# EAGLE design IPSv3.1 (EAGLE 9.6.1)

## Sheet 1 of 3: Circuit principal
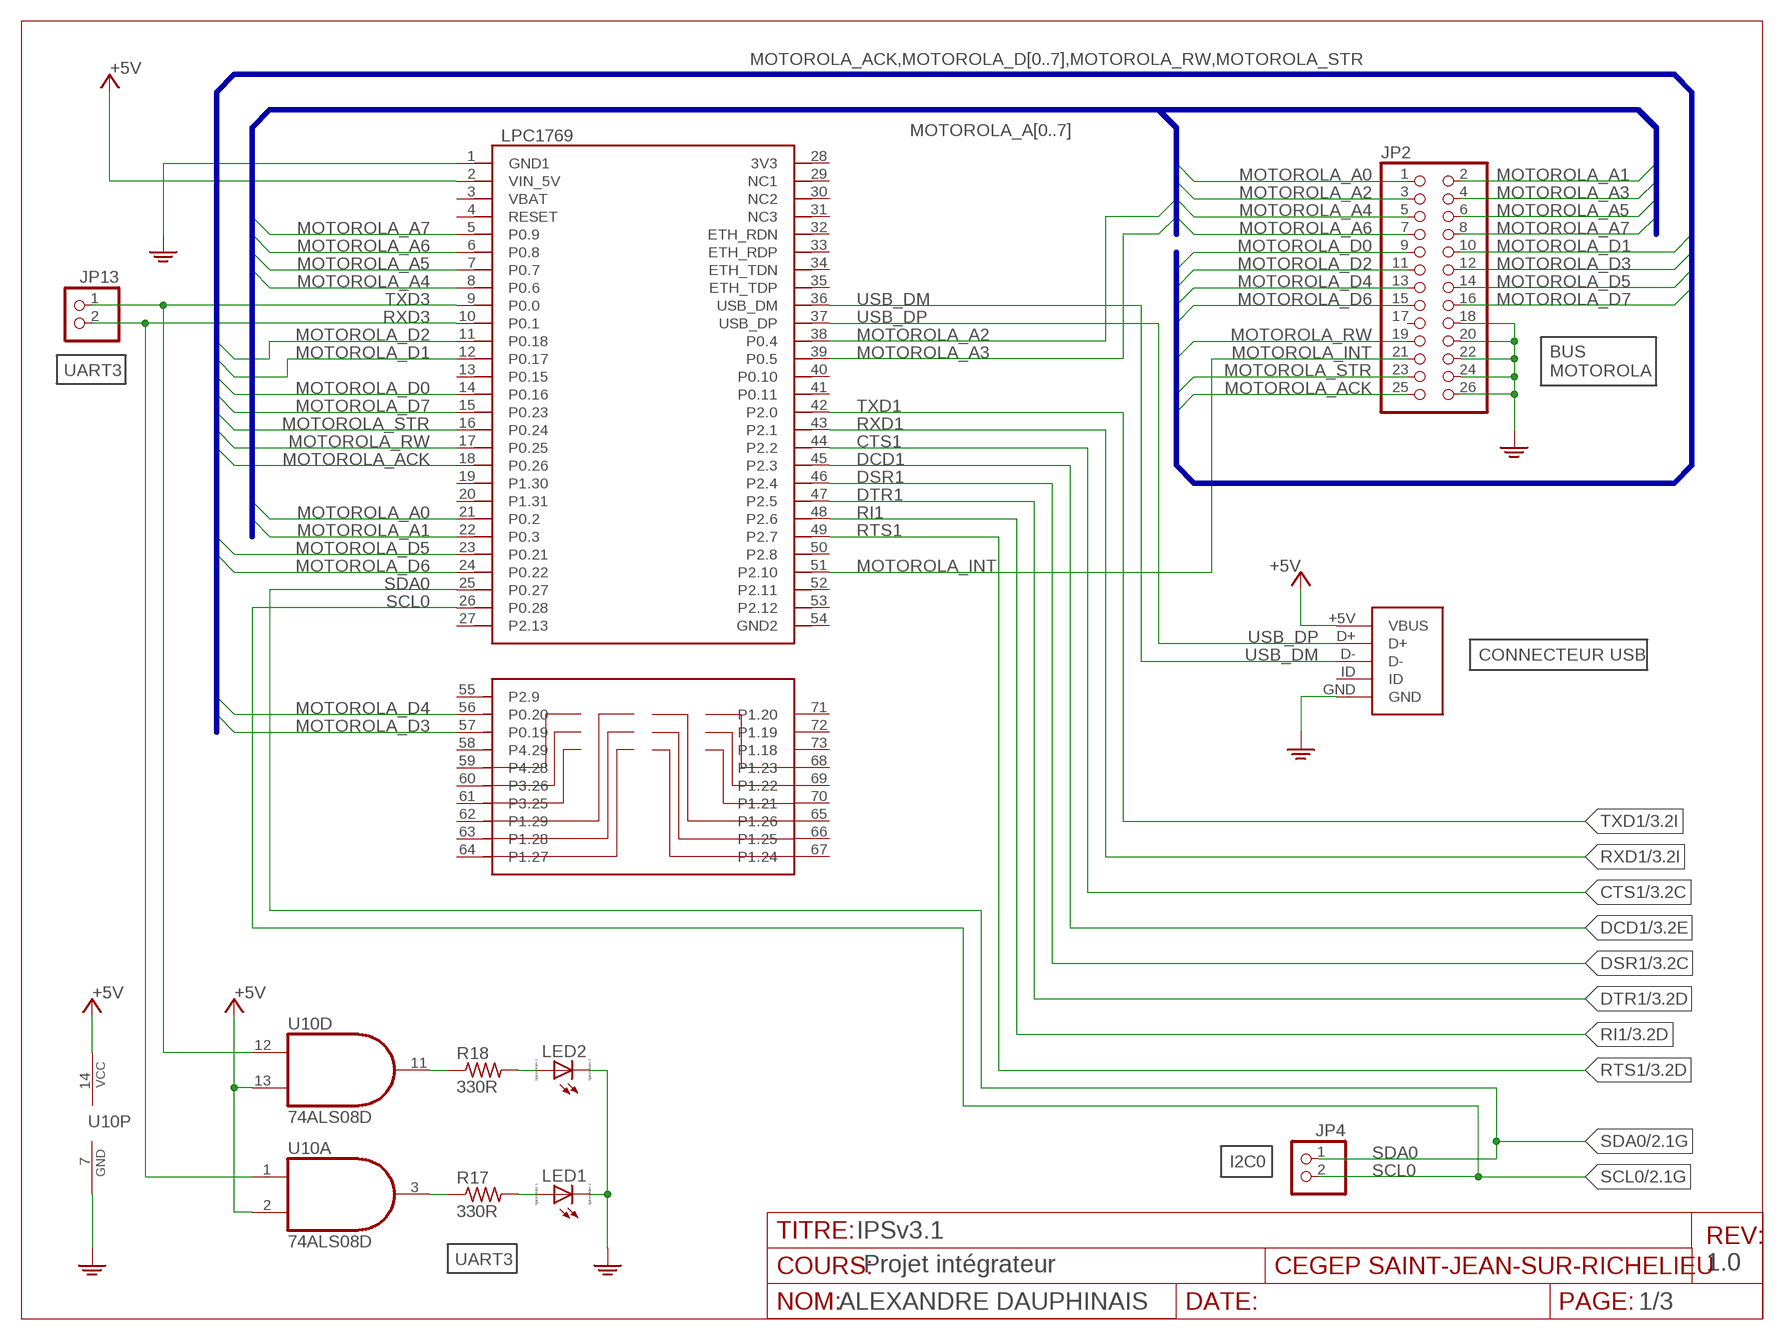
[diagram p0: schematic, sheet 1]

### Parts
JP2  PINHD-02X13M  [02X13M]
JP4  PINHD-01X02M  [01X02M]
JP13  PINHD-01X02M  [01X02M]
LED1  LED_BLEU  LED_E  [LED_1206]
LED2  LED_JAUNE  LED_E  [LED_1206]
M1  LPC_LPC1769  [LPC_LPC1769]
M2  USB-MICRO-BREAKOUT  [USB-MICRO-BREAKOUT]
R17  330R  R-US_R1206  [R1206]
R18  330R  R-US_R1206  [R1206]
U10  74ALS08D  [SO14]

### Nets
+5V: M1.2(VIN_5V) M2.+5V(VBUS) U10.2(A:I1) U10.13(D:I1) U10.14(P:VCC) ; also sheet 2,3
CTS1: M1.44(P2.2) ; also sheet 3
DCD1: M1.45(P2.3) ; also sheet 3
DSR1: M1.46(P2.4) ; also sheet 3
DTR1: M1.47(P2.5) ; also sheet 3
GND: JP2.18 JP2.20 JP2.22 JP2.24 JP2.26 LED1.C LED2.C M1.1(GND1) M2.GND U10.7(P:GND) ; also sheet 2,3
MOTOROLA_A0: JP2.1 M1.21(P0.2)
MOTOROLA_A1: JP2.2 M1.22(P0.3)
MOTOROLA_A2: JP2.3 M1.38(P0.4)
MOTOROLA_A3: JP2.4 M1.39(P0.5)
MOTOROLA_A4: JP2.5 M1.8(P0.6)
MOTOROLA_A5: JP2.6 M1.7(P0.7)
MOTOROLA_A6: JP2.7 M1.6(P0.8)
MOTOROLA_A7: JP2.8 M1.5(P0.9)
MOTOROLA_ACK: JP2.25 M1.18(P0.26)
MOTOROLA_D0: JP2.9 M1.14(P0.16)
MOTOROLA_D1: JP2.10 M1.12(P0.17)
MOTOROLA_D2: JP2.11 M1.11(P0.18)
MOTOROLA_D3: JP2.12 M1.57(P0.19)
MOTOROLA_D4: JP2.13 M1.56(P0.20)
MOTOROLA_D5: JP2.14 M1.23(P0.21)
MOTOROLA_D6: JP2.15 M1.24(P0.22)
MOTOROLA_D7: JP2.16 M1.15(P0.23)
MOTOROLA_INT: JP2.21 M1.51(P2.10)
MOTOROLA_RW: JP2.19 M1.17(P0.25)
MOTOROLA_STR: JP2.23 M1.16(P0.24)
N$2: R17.1 U10.3(A:O)
N$6: R18.1 U10.11(D:O)
N$23: LED2.A R18.2
N$24: LED1.A R17.2
RI1: M1.48(P2.6) ; also sheet 3
RTS1: M1.49(P2.7) ; also sheet 3
RXD1: M1.43(P2.1) ; also sheet 3
RXD3: JP13.2 M1.10(P0.1) U10.1(A:I0)
SCL0: JP4.2 M1.26(P0.28) ; also sheet 2
SDA0: JP4.1 M1.25(P0.27) ; also sheet 2
TXD1: M1.42(P2.0) ; also sheet 3
TXD3: JP13.1 M1.9(P0.0) U10.12(D:I0)
USB_DM: M1.36(USB_DM) M2.D-
USB_DP: M1.37(USB_DP) M2.D+
Unconnected: JP2.17 M1.3(VBAT) M1.4(RESET) M1.13(P0.15) M1.19(P1.30) M1.20(P1.31) M1.27(P2.13) M1.28(3V3) M1.29(NC1) M1.30(NC2) M1.31(NC3) M1.32(ETH_RDN) M1.33(ETH_RDP) M1.34(ETH_TDN) M1.35(ETH_TDP) M1.40(P0.10) M1.41(P0.11) M1.50(P2.8) M1.52(P2.11) M1.53(P2.12) M1.54(GND2) M1.55(P2.9) M1.58(P4.29) M1.59(P4.28) M1.60(P3.26) M1.61(P3.25) M1.62(P1.29) M1.63(P1.28) M1.64(P1.27) M1.65(P1.26) M1.66(P1.25) M1.67(P1.24) M1.68(P1.23) M1.69(P1.22) M1.70(P1.21) M1.71(P1.20) M1.72(P1.19) M1.73(P1.18) M2.ID

### Buses
MOTOROLA_ACK,MOTOROLA_D[0..7],MOTOROLA_RW,MOTOROLA_STR
MOTOROLA_A[0..7]

### Notes on the sheet
- LPC1769
- UART3
- BUS
  MOTOROLA
- CONNECTEUR USB
- I2C0
- UART3
- Projet intégrateur

## Sheet 2 of 3: I2C0
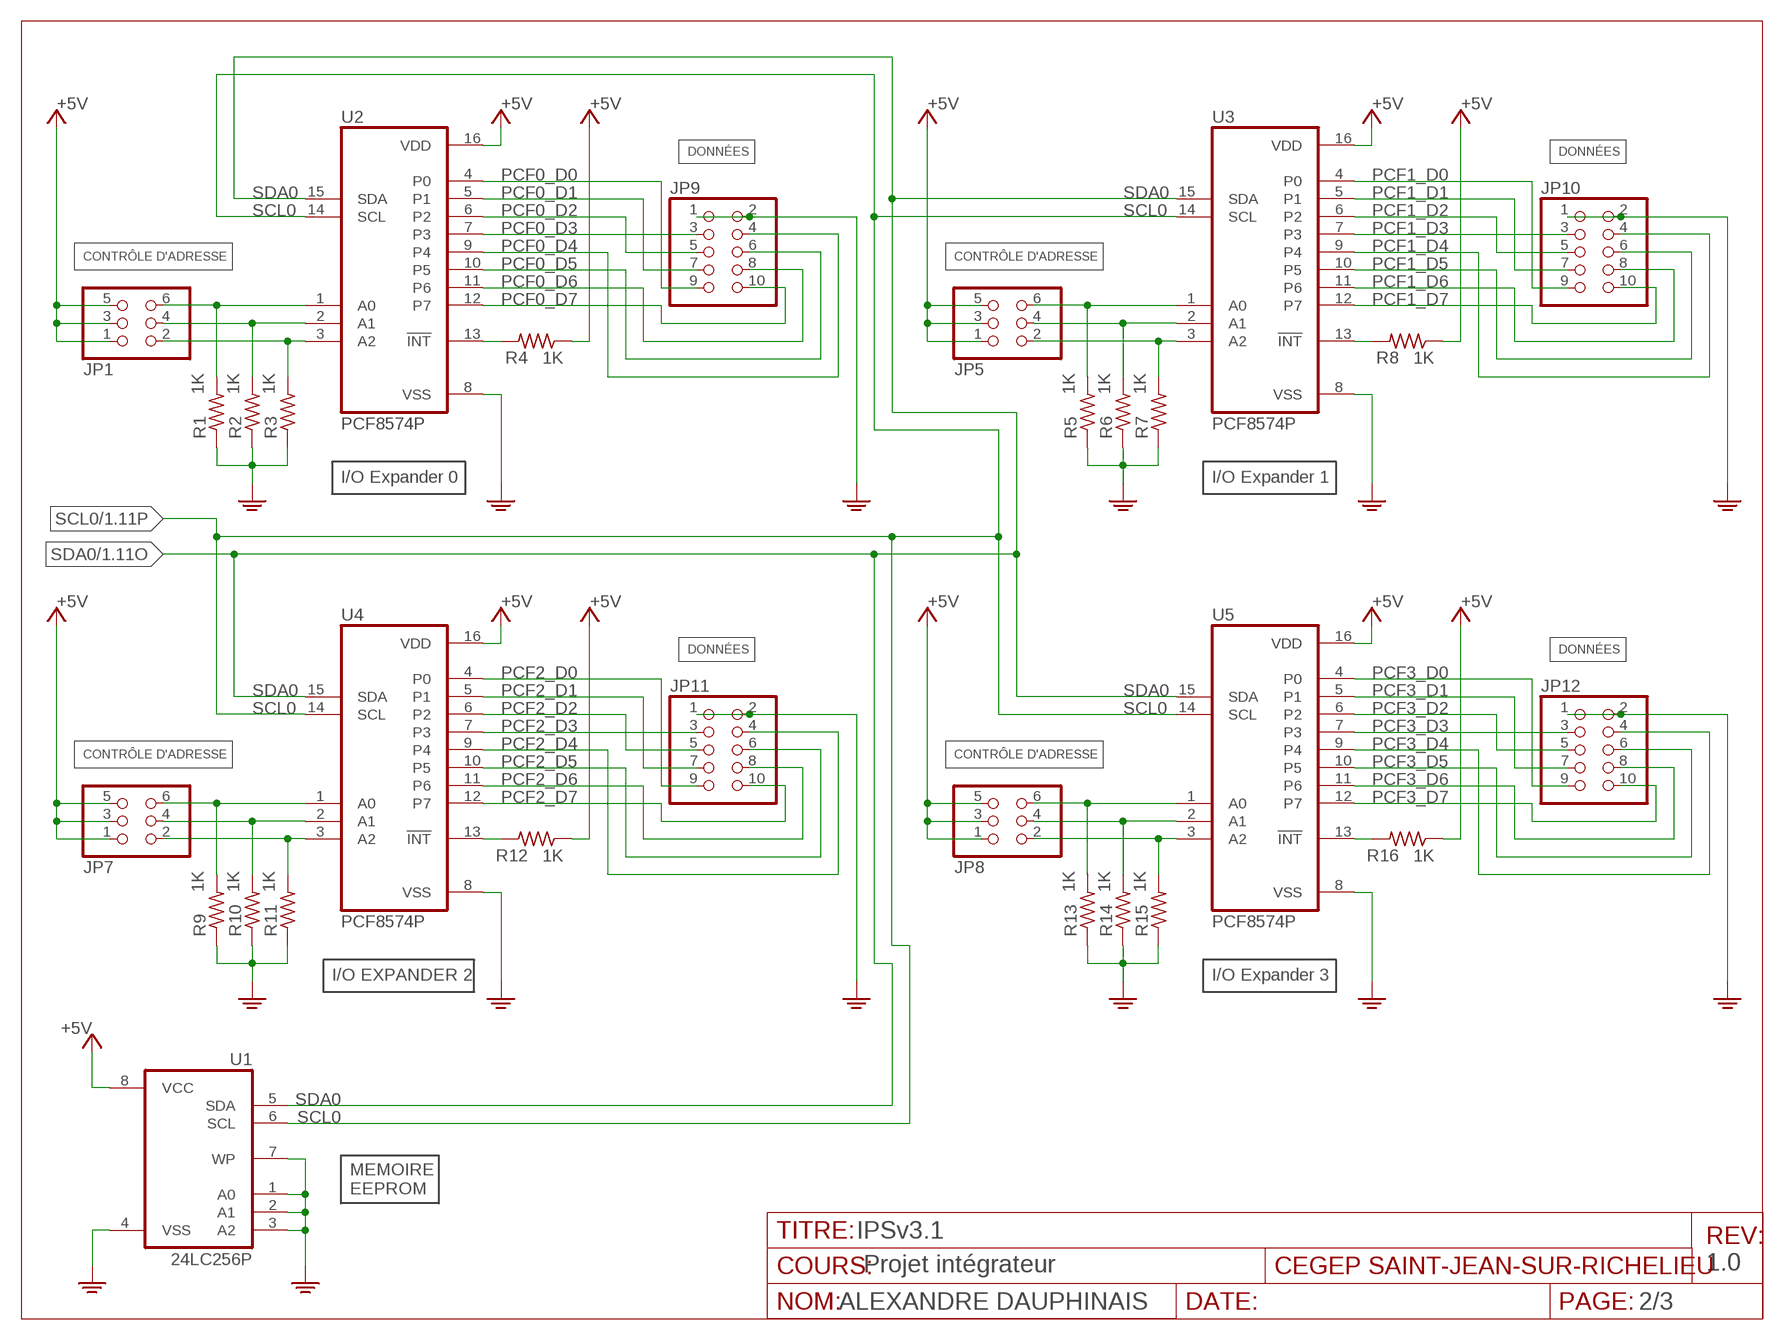
[diagram p1: schematic, sheet 2]

### Parts
JP1  PINHD-02X03M  [02X03M]
JP5  PINHD-02X03M  [02X03M]
JP7  PINHD-02X03M  [02X03M]
JP8  PINHD-02X03M  [02X03M]
JP9  PINHD-02X05M  [02X05M]
JP10  PINHD-02X05M  [02X05M]
JP11  PINHD-02X05M  [02X05M]
JP12  PINHD-02X05M  [02X05M]
R1  1K  R-US_R1206  [R1206]
R2  1K  R-US_R1206  [R1206]
R3  1K  R-US_R1206  [R1206]
R4  1K  R-US_R1206  [R1206]
R5  1K  R-US_R1206  [R1206]
R6  1K  R-US_R1206  [R1206]
R7  1K  R-US_R1206  [R1206]
R8  1K  R-US_R1206  [R1206]
R9  1K  R-US_R1206  [R1206]
R10  1K  R-US_R1206  [R1206]
R11  1K  R-US_R1206  [R1206]
R12  1K  R-US_R1206  [R1206]
R13  1K  R-US_R1206  [R1206]
R14  1K  R-US_R1206  [R1206]
R15  1K  R-US_R1206  [R1206]
R16  1K  R-US_R1206  [R1206]
U1  24LC256P  [DIL08]
U2  PCF8574P  [DIL16]
U3  PCF8574P  [DIL16]
U4  PCF8574P  [DIL16]
U5  PCF8574P  [DIL16]

### Nets
+5V: JP1.1 JP1.3 JP1.5 JP5.1 JP5.3 JP5.5 JP7.1 JP7.3 JP7.5 JP8.1 JP8.3 JP8.5 R4.1 R8.1 R12.1 R16.1 U1.8(VCC) U2.16(VDD) U3.16(VDD) U4.16(VDD) U5.16(VDD) ; also sheet 1,3
GND: JP9.1 JP9.2 JP10.1 JP10.2 JP11.1 JP11.2 JP12.1 JP12.2 R1.1 R2.1 R3.1 R5.1 R6.1 R7.1 R9.1 R10.1 R11.1 R13.1 R14.1 R15.1 U1.1(A0) U1.2(A1) U1.3(A2) U1.4(VSS) U1.7(WP) U2.8(VSS) U3.8(VSS) U4.8(VSS) U5.8(VSS) ; also sheet 1,3
N$1: R8.2 U3.13(!INT)
N$3: R12.2 U4.13(!INT)
N$4: R4.2 U2.13(!INT)
N$8: R16.2 U5.13(!INT)
PCF0_A0: JP1.6 R1.2 U2.1(A0)
PCF0_A1: JP1.4 R2.2 U2.2(A1)
PCF0_A2: JP1.2 R3.2 U2.3(A2)
PCF0_D0: JP9.9 U2.4(P0)
PCF0_D1: JP9.7 U2.5(P1)
PCF0_D2: JP9.5 U2.6(P2)
PCF0_D3: JP9.3 U2.7(P3)
PCF0_D4: JP9.4 U2.9(P4)
PCF0_D5: JP9.6 U2.10(P5)
PCF0_D6: JP9.8 U2.11(P6)
PCF0_D7: JP9.10 U2.12(P7)
PCF1_A0: JP5.6 R5.2 U3.1(A0)
PCF1_A1: JP5.4 R6.2 U3.2(A1)
PCF1_A2: JP5.2 R7.2 U3.3(A2)
PCF1_D0: JP10.9 U3.4(P0)
PCF1_D1: JP10.7 U3.5(P1)
PCF1_D2: JP10.5 U3.6(P2)
PCF1_D3: JP10.3 U3.7(P3)
PCF1_D4: JP10.4 U3.9(P4)
PCF1_D5: JP10.6 U3.10(P5)
PCF1_D6: JP10.8 U3.11(P6)
PCF1_D7: JP10.10 U3.12(P7)
PCF2_A0: JP7.6 R9.2 U4.1(A0)
PCF2_A1: JP7.4 R10.2 U4.2(A1)
PCF2_A2: JP7.2 R11.2 U4.3(A2)
PCF2_D0: JP11.9 U4.4(P0)
PCF2_D1: JP11.7 U4.5(P1)
PCF2_D2: JP11.5 U4.6(P2)
PCF2_D3: JP11.3 U4.7(P3)
PCF2_D4: JP11.4 U4.9(P4)
PCF2_D5: JP11.6 U4.10(P5)
PCF2_D6: JP11.8 U4.11(P6)
PCF2_D7: JP11.10 U4.12(P7)
PCF3_A0: JP8.6 R13.2 U5.1(A0)
PCF3_A1: JP8.4 R14.2 U5.2(A1)
PCF3_A2: JP8.2 R15.2 U5.3(A2)
PCF3_D0: JP12.9 U5.4(P0)
PCF3_D1: JP12.7 U5.5(P1)
PCF3_D2: JP12.5 U5.6(P2)
PCF3_D3: JP12.3 U5.7(P3)
PCF3_D4: JP12.4 U5.9(P4)
PCF3_D5: JP12.6 U5.10(P5)
PCF3_D6: JP12.8 U5.11(P6)
PCF3_D7: JP12.10 U5.12(P7)
SCL0: U1.6(SCL) U2.14(SCL) U3.14(SCL) U4.14(SCL) U5.14(SCL) ; also sheet 1
SDA0: U1.5(SDA) U2.15(SDA) U3.15(SDA) U4.15(SDA) U5.15(SDA) ; also sheet 1

### Notes on the sheet
- DONNÉES | DONNÉES
- CONTRÔLE D'ADRESSE | CONTRÔLE D'ADRESSE
- I/O Expander 0 | I/O Expander 1
- DONNÉES | DONNÉES
- CONTRÔLE D'ADRESSE | CONTRÔLE D'ADRESSE
- I/O EXPANDER 2 | I/O Expander 3
- MEMOIRE
  EEPROM
- Projet intégrateur

## Sheet 3 of 3: UART1
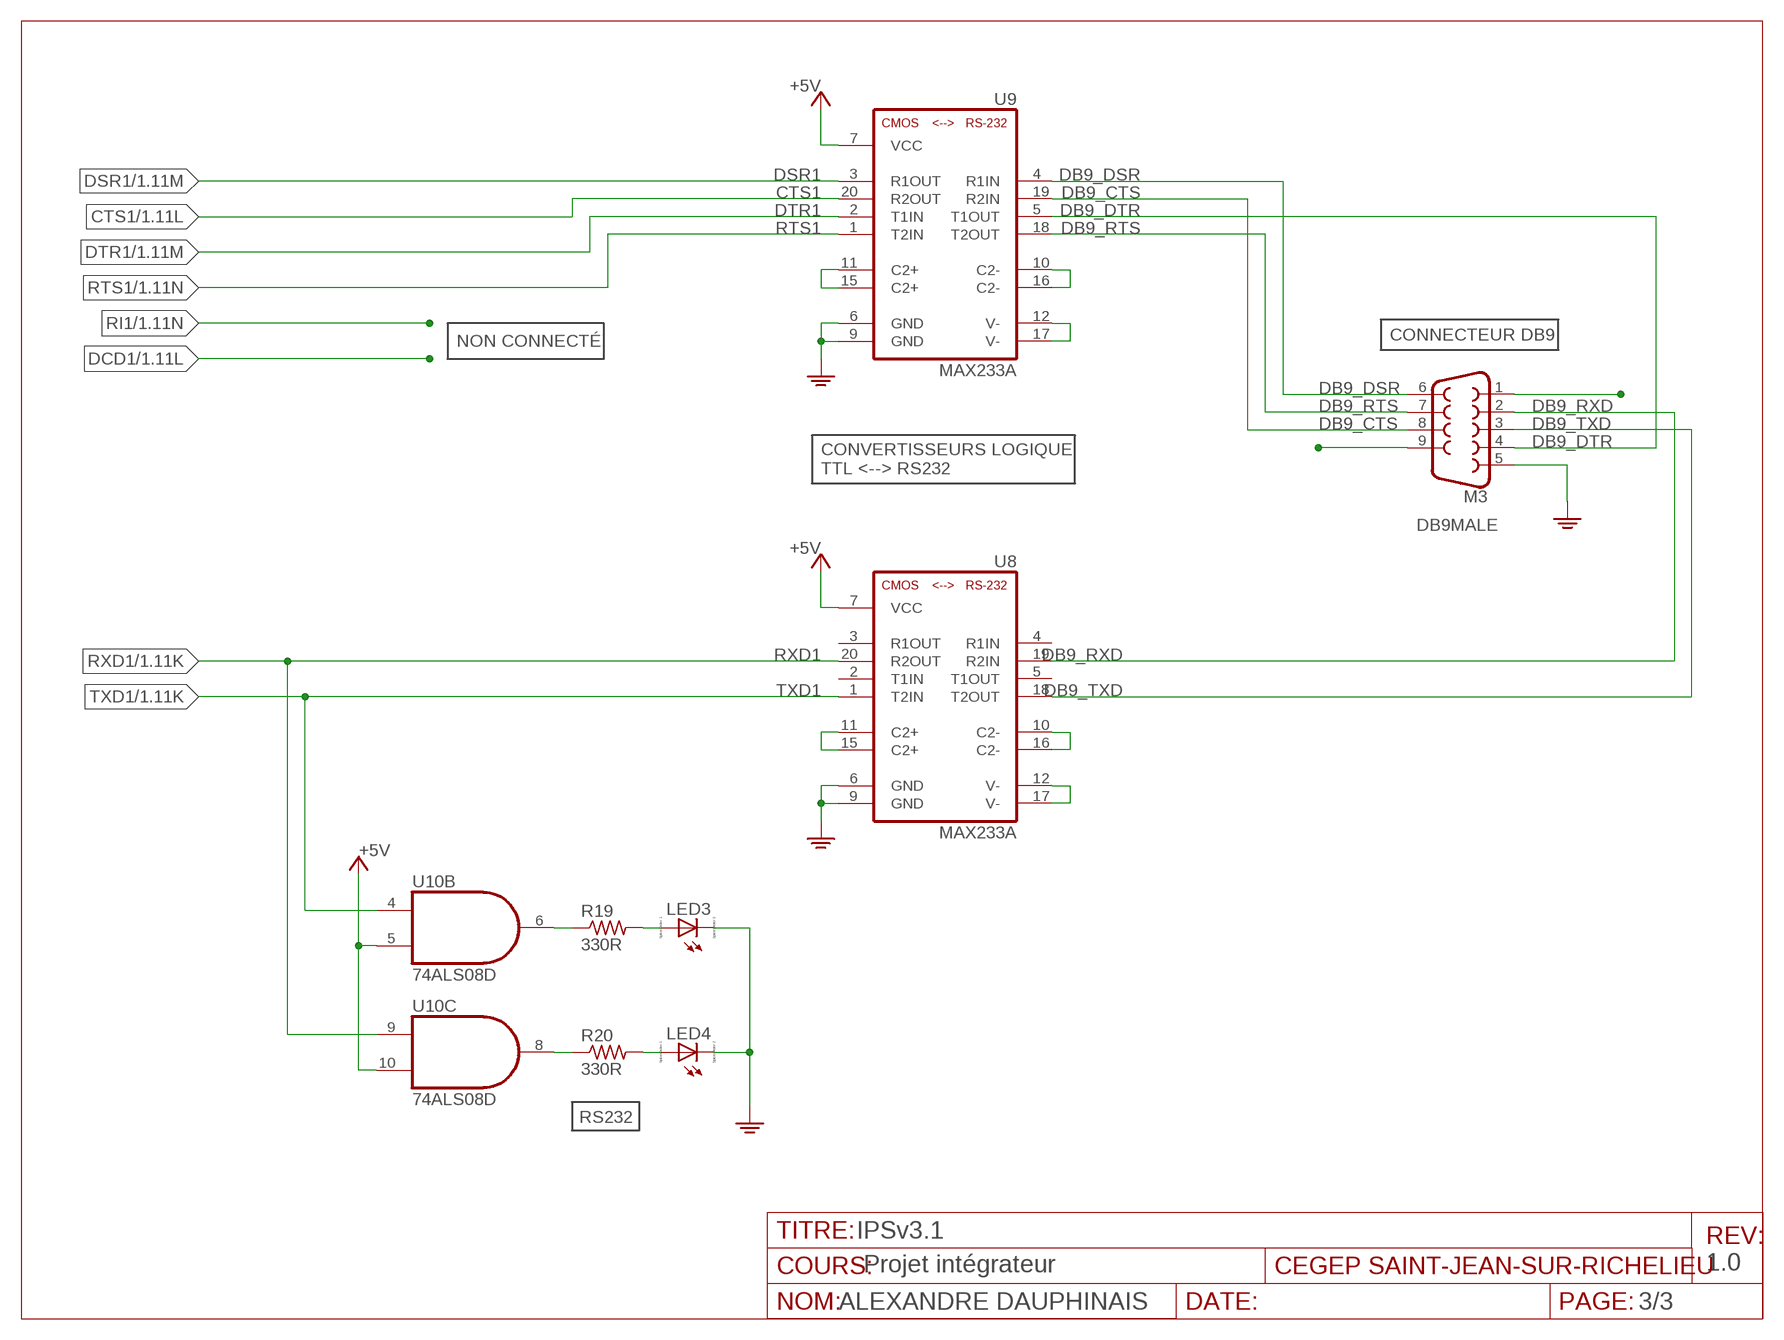
[diagram p2: schematic, sheet 3]

### Parts
LED3  LED_JAUNE  LED_E  [LED_1206]
LED4  LED_BLEU  LED_E  [LED_1206]
M3  DB9MALE  DB9FEMALE  [DB9]
R19  330R  R-US_R1206  [R1206]
R20  330R  R-US_R1206  [R1206]
U8  MAX233A  MAX233ACPP  [DIL20]
U9  MAX233A  MAX233ACPP  [DIL20]

### Nets
+5V: U8.7(VCC) U9.7(VCC) U10.5(B:I1) U10.10(C:I1) ; also sheet 1,2
CTS1: U9.20(R2OUT) ; also sheet 1
DB9_CTS: M3.8 U9.19(R2IN)
DB9_DSR: M3.6 U9.4(R1IN)
DB9_DTR: M3.4 U9.5(T1OUT)
DB9_RTS: M3.7 U9.18(T2OUT)
DB9_RXD: M3.2 U8.19(R2IN)
DB9_TXD: M3.3 U8.18(T2OUT)
DSR1: U9.3(R1OUT) ; also sheet 1
DTR1: U9.2(T1IN) ; also sheet 1
GND: LED3.C LED4.C M3.5 U8.6(GND) U8.9(GND) U9.6(GND) U9.9(GND) ; also sheet 1,2
N$5: R19.1 U10.6(B:O)
N$7: M3.9
N$9: U8.12(V-) U8.17(V-)
N$10: R20.1 U10.8(C:O)
N$13: U8.10(C2-) U8.16(C2-)
N$14: U8.11(C2+) U8.15(C2+)
N$15: U9.12(V-) U9.17(V-)
N$16: U9.10(C2-) U9.16(C2-)
N$17: U9.11(C2+) U9.15(C2+)
N$18: LED3.A R19.2
N$19: LED4.A R20.2
N$20: M3.1
RTS1: U9.1(T2IN) ; also sheet 1
RXD1: U8.20(R2OUT) U10.9(C:I0) ; also sheet 1
TXD1: U8.1(T2IN) U10.4(B:I0) ; also sheet 1
Unconnected: U8.2(T1IN) U8.3(R1OUT) U8.4(R1IN) U8.5(T1OUT)

### Notes on the sheet
- NON CONNECTÉ | CONNECTEUR DB9
- CONVERTISSEURS LOGIQUE
  TTL <--> RS232
- RS232
- Projet intégrateur

## Library data of the parts
JP1 JP5 JP7 JP8 = pinheadFemale:PINHD-02X03: PIN HEADER
JP2 = pinheadFemale:PINHD-02X13: PIN HEADER
JP4 JP13 = pinheadFemale:PINHD-01X02: PIN HEADER
JP9-JP12 = pinheadFemale:PINHD-02X05: PIN HEADER
LED1-LED4 = eagle-ltspice:LED_E: LED Source: http://www.osram.convergy.de Source: www.luxeon.com Source: www.kingbright.com; SPICEMODEL: NONE; SPICEPREFIX: D; SPICETYPE: diode
M1 = 11_PCB:LPC_LPC1769: LPC1769
M2 = 11_CONNECTORS:USB-MICRO-BREAKOUT: USB Micro-B Breakout 100mil
M3 = 11_CONNECTORS:DB9: DB9 Connector Standard DB9 (D-Sub 9) serial connector. Can be used for CAN bus as well as RS485 and RS232. Footprint production proven. Here is the female version connector we sell at SparkFun: 9 Pin Female Serial Connector - PCB Mount <https://www.sparkfun.com/products/429> (PRT-00429) This connector has been used on the following SparkFun products: SparkFun RS232 Shifter - SMD <https://www.sparkfun.com/products/449> (PRT-00449) SparkFun RS232 Shifter SMD (No DB9) <https://www.sparkfun.com/products/8780> (PRT-08780); PROD_ID: CONN-08194
R1-R20 = rcl:R-US_: RESISTOR, American symbol; SPICEPREFIX: R
U1 = 11_Actifs:24LC256: EEPROM 32K x 8 avec interface I2C Microchip
U2-U5 = 11_Actifs:PCF8574: Interface parallèle de 8 bits pour entrées/sorties sur bus I2C Philips
U8 U9 = 11_Actifs:MAX233A: Traducteurs de niveau 2x RS-232 à TTL/CMOS et 2x TTL/CMOS à RS-232 à alimentation unique +5V Maxim
U10 = 74xx-us:74*08: Quad 2-input AND gate

## Board
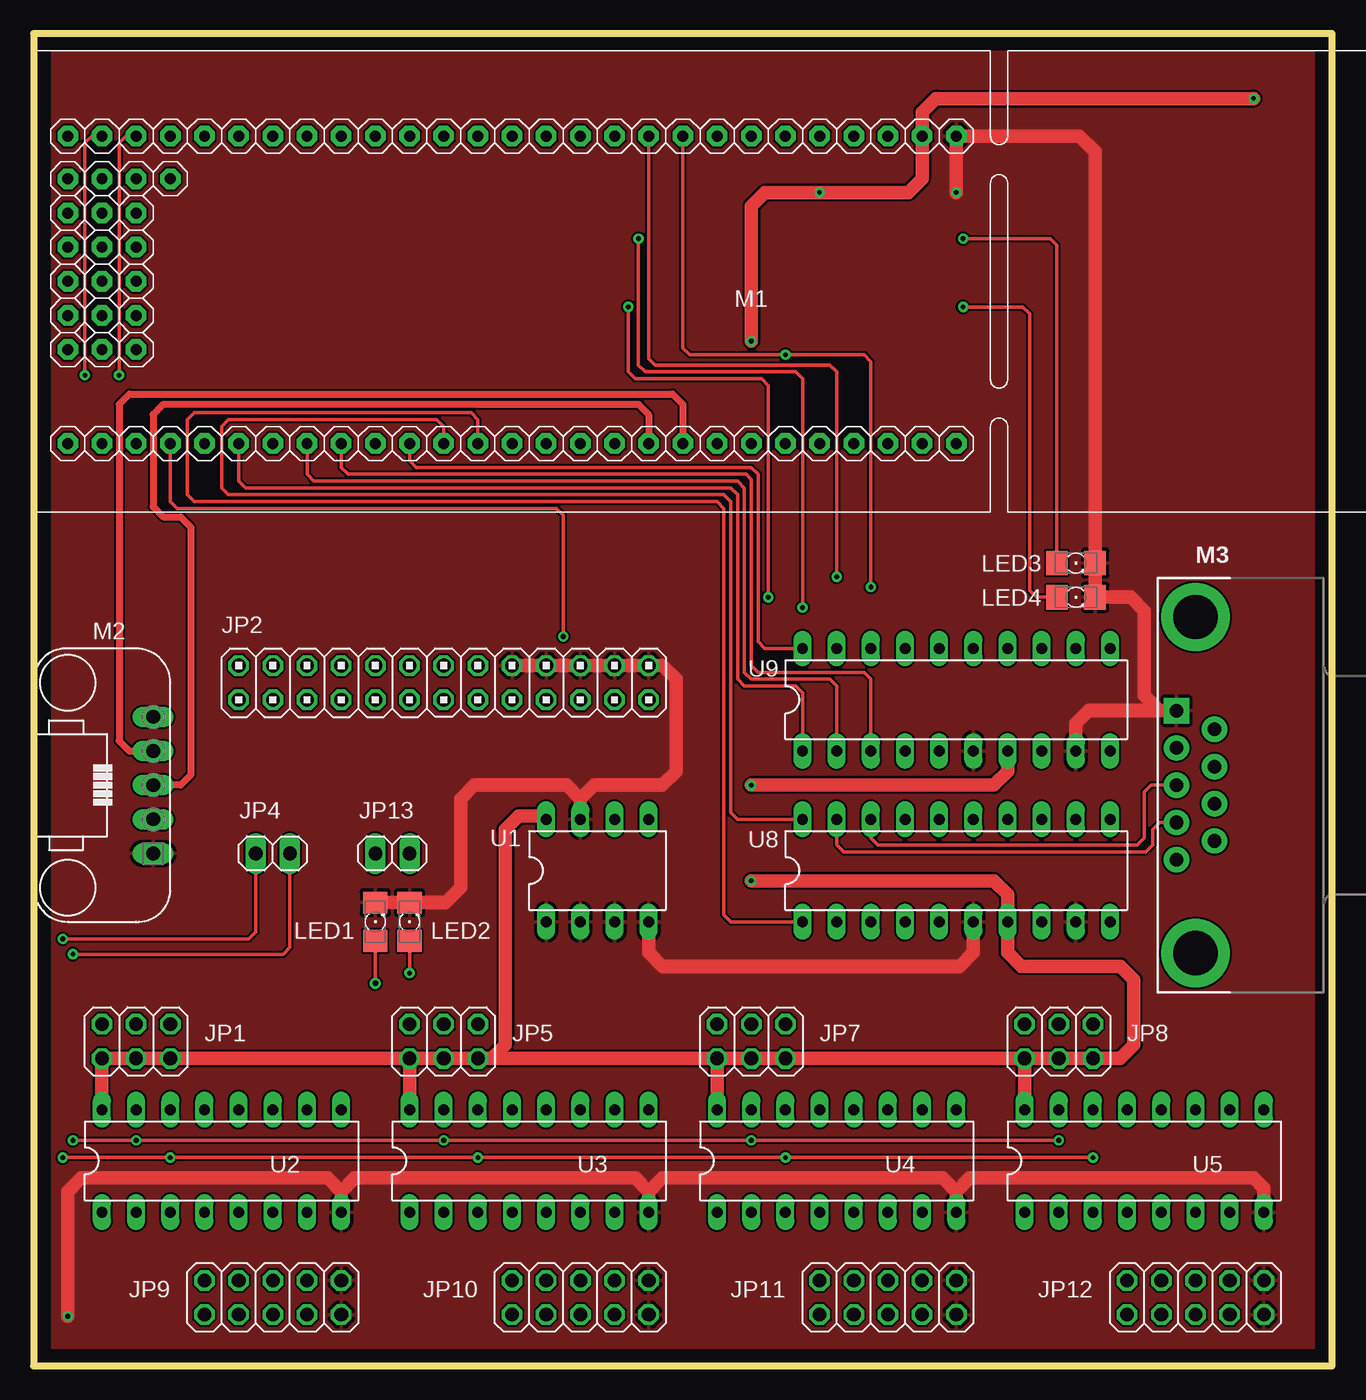
[diagram p3: board, top side]
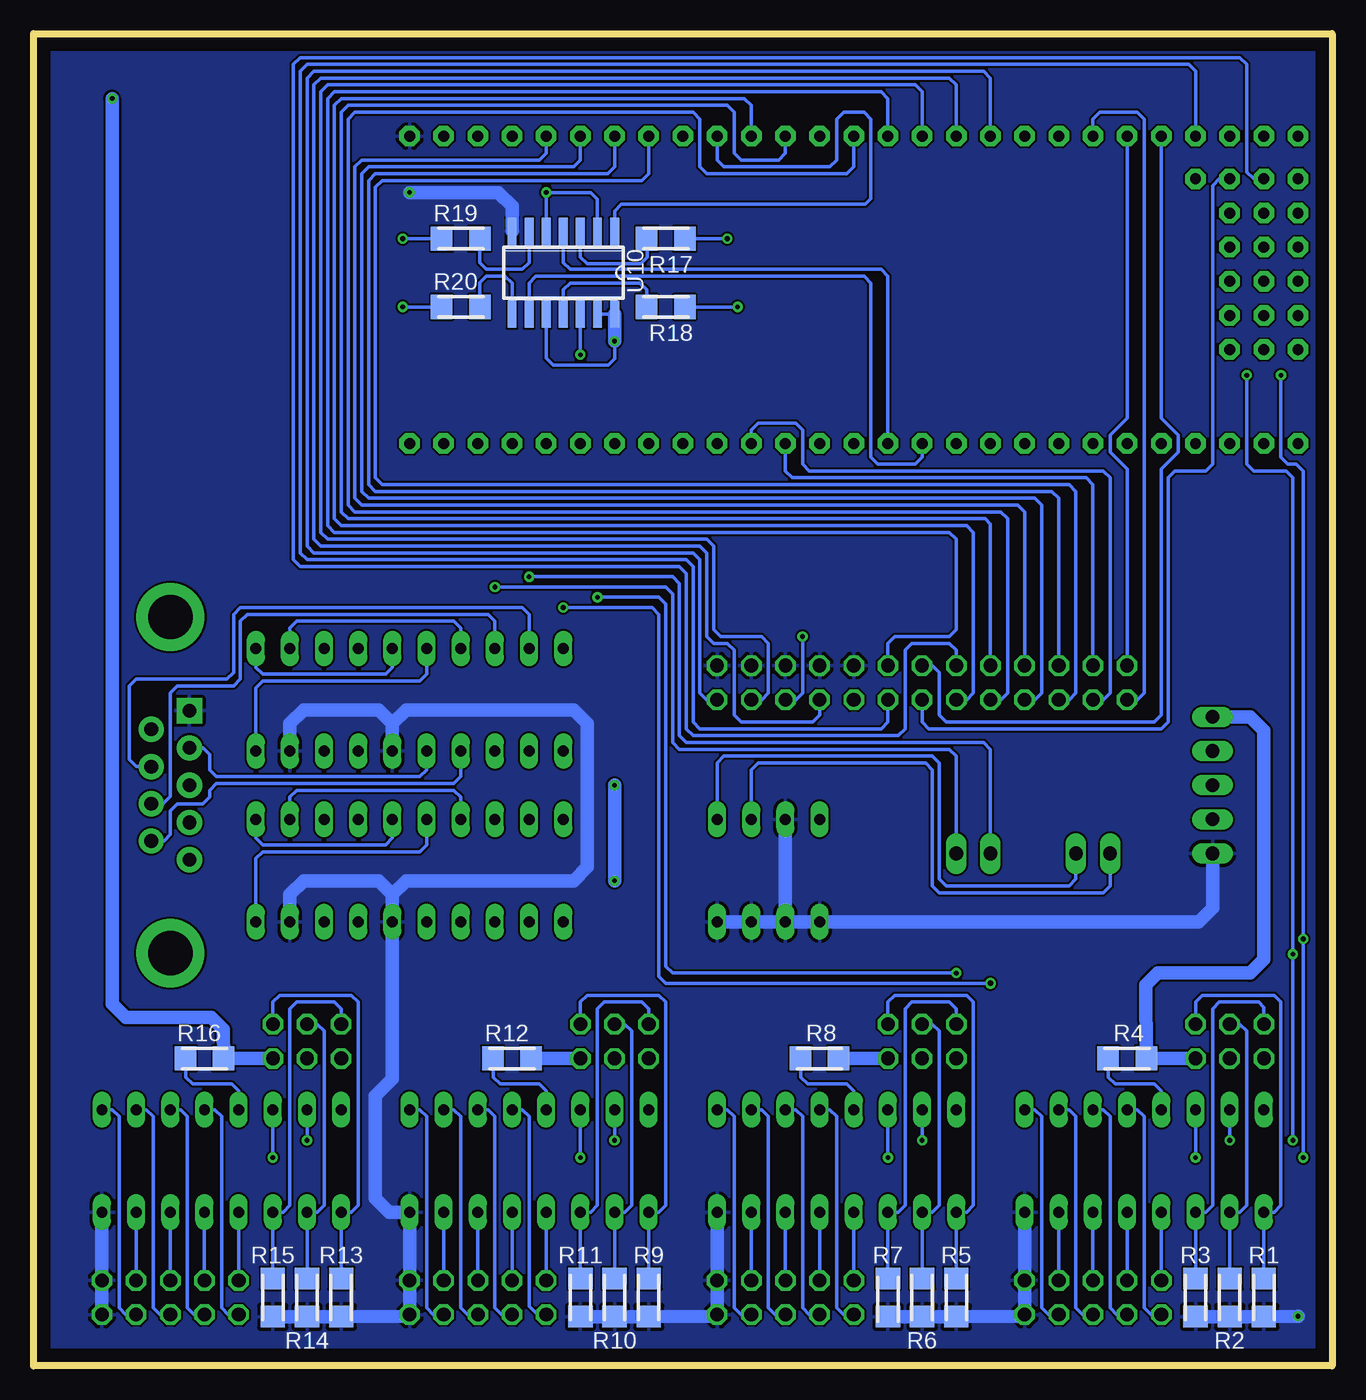
[diagram p4: board, bottom side, seen from below]

Size 96.52 x 99.06 mm. Coordinates in mm from the lower left corner, seen from the top.
Outline: 0,0 96.52,0 96.52,99.06 0,99.06 0,0
Copper layers (1*16): Top 0.035mm / dielectric 1.5mm / Bottom 0.035mm
Design rules "default": minimum track width 6mil, minimum drill 0.35mm, track to track 6mil, track to pad 6mil, pad to pad 6mil, via to via 6mil, smd to smd 6mil, copper to edge 40mil, drill to drill 6mil, minimum pad ring 10mil, minimum via ring 8mil, stop-mask expansion 4mil, vias tented up to drill 0mil, thermal gap 10mil

### Footprints (pad centres in the part's own frame; a part is rotated, then mirrored left to right if it is on the bottom)
02X03M = drill 1.016 octagon: 1 -2.54,-1.27; 2 -2.54,1.27; 3 0,-1.27; 4 0,1.27; 5 2.54,-1.27; 6 2.54,1.27
02X13M = drill 1.016 octagon: 1 -15.24,-1.27; 2 -15.24,1.27; 3 -12.7,-1.27; 4 -12.7,1.27; 5 -10.16,-1.27; 6 -10.16,1.27; 7 -7.62,-1.27; 8 -7.62,1.27; 9 -5.08,-1.27; 10 -5.08,1.27; 11 -2.54,-1.27; 12 -2.54,1.27; 13 0,-1.27; 14 0,1.27; 15 2.54,-1.27; 16 2.54,1.27; 17 5.08,-1.27; 18 5.08,1.27; 19 7.62,-1.27; 20 7.62,1.27; 21 10.16,-1.27; 22 10.16,1.27; 23 12.7,-1.27; 24 12.7,1.27; 25 15.24,-1.27; 26 15.24,1.27
01X02M = drill 1.016 long: 1 -1.27,0; 2 1.27,0
02X05M = drill 1.016 octagon: 1 -5.08,-1.27; 2 -5.08,1.27; 3 -2.54,-1.27; 4 -2.54,1.27; 5 0,-1.27; 6 0,1.27; 7 2.54,-1.27; 8 2.54,1.27; 9 5.08,-1.27; 10 5.08,1.27
LED_1206 = smd 1.6 x 1.803: A -1.422,0; C 1.422,0
LPC_LPC1769 = drill 0.813 pad 1.524 octagon: 1 -11.43,25.4; 2 -11.43,22.86; 3 -11.43,20.32; 4 -11.43,17.78; 5 -11.43,15.24; 6 -11.43,12.7; 7 -11.43,10.16; 8 -11.43,7.62; 9 -11.43,5.08; 10 -11.43,2.54; 11 -11.43,0; 12 -11.43,-2.54; 13 -11.43,-5.08; 14 -11.43,-7.62; 15 -11.43,-10.16; 16 -11.43,-12.7; 17 -11.43,-15.24; 18 -11.43,-17.78; 19 -11.43,-20.32; 20 -11.43,-22.86; 21 -11.43,-25.4; 22 -11.43,-27.94; 23 -11.43,-30.48; 24 -11.43,-33.02; 25 -11.43,-35.56; 26 -11.43,-38.1; 27 -11.43,-40.64; 28 11.43,25.4; 29 11.43,22.86; 30 11.43,20.32; 31 11.43,17.78; 32 11.43,15.24; 33 11.43,12.7; 34 11.43,10.16; 35 11.43,7.62; 36 11.43,5.08; 37 11.43,2.54; 38 11.43,0; 39 11.43,-2.54; 40 11.43,-5.08; 41 11.43,-7.62; 42 11.43,-10.16; 43 11.43,-12.7; 44 11.43,-15.24; 45 11.43,-17.78; 46 11.43,-20.32; 47 11.43,-22.86; 48 11.43,-25.4; 49 11.43,-27.94; 50 11.43,-30.48; 51 11.43,-33.02; 52 11.43,-35.56; 53 11.43,-38.1; 54 11.43,-40.64; 55 -8.255,-33.02; 56 -8.255,-35.56; 57 -8.255,-38.1; 58 -8.255,-40.64; 59 -5.715,-35.56; 60 -5.715,-38.1; 61 -5.715,-40.64; 62 -3.175,-35.56; 63 -3.175,-38.1; 64 -3.175,-40.64; 65 -0.635,-35.56; 66 -0.635,-38.1; 67 -0.635,-40.64; 68 1.905,-35.56; 69 1.905,-38.1; 70 1.905,-40.64; 71 4.445,-35.56; 72 4.445,-38.1; 73 4.445,-40.64
USB-MICRO-BREAKOUT = drill 1.016 long: +5V 5.08,0; D+ 0,0; D- 2.54,0; GND -5.08,0; ID -2.54,0
DB9 = drill 1.016 pad 1.88: 1 5.54,-1.42; 2 2.77,-1.42; 3 0,-1.42; 4 -2.77,-1.42; 6 4.15,1.42; 7 1.38,1.42; 8 -1.38,1.42; 9 -4.15,1.42 | drill 1.016 pad 1.88 square: 5 -5.54,-1.42 | drill 3.302 pad 5.08: G1 -12.5,0; G2 12.5,0
R1206 = smd 1.6 x 1.803: 1 -1.422,0; 2 1.422,0
DIL08 = drill 0.813 long: 1 -3.81,-3.81; 2 -1.27,-3.81; 3 1.27,-3.81; 4 3.81,-3.81; 5 3.81,3.81; 6 1.27,3.81; 7 -1.27,3.81; 8 -3.81,3.81
DIL16 = drill 0.813 long: 1 -8.89,-3.81; 2 -6.35,-3.81; 3 -3.81,-3.81; 4 -1.27,-3.81; 5 1.27,-3.81; 6 3.81,-3.81; 7 6.35,-3.81; 8 8.89,-3.81; 9 8.89,3.81; 10 6.35,3.81; 11 3.81,3.81; 12 1.27,3.81; 13 -1.27,3.81; 14 -3.81,3.81; 15 -6.35,3.81; 16 -8.89,3.81
DIL20 = drill 0.813 long: 1 -11.43,-3.81; 2 -8.89,-3.81; 3 -6.35,-3.81; 4 -3.81,-3.81; 5 -1.27,-3.81; 6 1.27,-3.81; 7 3.81,-3.81; 8 6.35,-3.81; 9 8.89,-3.81; 10 11.43,-3.81; 11 11.43,3.81; 12 8.89,3.81; 13 6.35,3.81; 14 3.81,3.81; 15 1.27,3.81; 16 -1.27,3.81; 17 -3.81,3.81; 18 -6.35,3.81; 19 -8.89,3.81; 20 -11.43,3.81
SO14 = smd 0.66 x 2.032: 1 -3.81,-3.073; 2 -2.54,-3.073; 3 -1.27,-3.073; 4 0,-3.073; 5 1.27,-3.073; 6 2.54,-3.073; 7 3.81,-3.073; 8 3.81,3.073; 9 2.54,3.073; 10 1.27,3.073; 11 0,3.073; 12 -1.27,3.073; 13 -2.54,3.073; 14 -3.81,3.073

### Placement (x,y rotation side)
JP1  7.62,24.13 0 top
JP2  30.48,50.8 0 top
JP4  17.78,38.1 180 top
JP5  30.48,24.13 0 top
JP7  53.34,24.13 0 top
JP8  76.2,24.13 0 top
JP9  17.78,5.08 180 top
JP10  40.64,5.08 180 top
JP11  63.5,5.08 180 top
JP12  86.36,5.08 180 top
JP13  26.67,38.1 180 top
LED1  25.4,33.02 90 top
LED2  27.94,33.02 90 top
LED3  77.47,59.69 0 top
LED4  77.47,57.15 0 top
M1  43.18,80.01 270 top
M2  8.89,43.18 90 top
M3  86.36,43.18 270 top
R1  5.08,5.08 90 bottom
R2  7.62,5.08 90 bottom
R3  10.16,5.08 90 bottom
R4  15.24,22.86 180 bottom
R5  27.94,5.08 90 bottom
R6  30.48,5.08 90 bottom
R7  33.02,5.08 90 bottom
R8  38.1,22.86 180 bottom
R9  50.8,5.08 90 bottom
R10  53.34,5.08 90 bottom
R11  55.88,5.08 90 bottom
R12  60.96,22.86 180 bottom
R13  73.66,5.08 90 bottom
R14  76.2,5.08 90 bottom
R15  78.74,5.08 90 bottom
R16  83.82,22.86 180 bottom
R17  49.53,83.82 0 bottom
R18  49.53,78.74 0 bottom
R19  64.77,83.82 180 bottom
R20  64.77,78.74 180 bottom
U1  41.91,36.83 0 top
U2  13.97,15.24 0 top
U3  36.83,15.24 0 top
U4  59.69,15.24 0 top
U5  82.55,15.24 0 top
U8  68.58,36.83 0 top
U9  68.58,49.53 0 top
U10  57.15,81.28 180 bottom

### Tracks (layer width: path | path; a pad name or v marks a point on that pad's centre or on a via)
+5V  (via drill 0.35)
  Top 1.016: U9.7 72.39,44.2 71.37,43.18 v53.34,43.18 | v53.34,36.07 71.37,36.07 72.39,35.05 U8.7 72.39,30.73 73.41,29.72 80.77,29.72 81.79,28.7 81.79,23.88 80.77,22.86 JP8.5 JP8.3 JP8.1 | v90.68,94.23 67.06,94.23 66.04,93.22 M1.2 66.04,88.27 65.02,87.25 v58.42,87.25 54.36,87.25 53.34,86.23 v53.34,76.2 | U2.16 JP1.1 JP1.3 JP1.5 JP5.1 | U5.16 JP8.1 | U4.16 JP7.1 | JP7.1 JP7.3 JP7.5 JP8.1 | U3.16 JP5.1 | JP5.1 JP5.3 JP5.5 34.04,22.86 | 34.04,22.86 JP7.1 | 34.04,22.86 35.05,23.88 35.05,39.88 36.07,40.89 37.85,40.89 U1.8
  Bottom 0.254: U10.2 54.61,86.77 55.09,87.25 v58.42,87.25 U10.5 | U10.13 U10.14 | U10.10 58.42,74.93 57.91,74.42 53.81,74.42 53.34,74.89 v53.34,76.2
  Bottom 1.016: v53.34,43.18 v53.34,36.07 | M2.+5V 6.1,48.26 5.08,47.24 5.08,30.23 6.1,29.21 12.95,29.21 13.84,28.32 R4.1 JP1.5 | v90.68,94.23 90.68,26.92 89.66,25.91 83.31,25.91 82.42,25.02 R16.1 JP8.5 | JP5.5 R8.1 | JP7.5 R12.1 | U10.14 v53.34,76.2
CTS1
  Top 0.254: U9.20 54.36,53.34 53.85,53.85 53.85,66.29 53.34,66.8 28.45,66.8 27.94,67.31 M1.44
DB9_CTS
  Bottom 0.254: M3.8 88.88,44.56 89.41,45.09 89.41,50.55 88.9,51.05 82.17,51.05 81.66,51.56 81.66,55.88 81.15,56.39 60.2,56.39 59.69,55.88 U9.19
DB9_DSR
  Bottom 0.254: M3.6 86.83,39.03 86.36,39.5 86.36,41.27 85.85,41.78 83.95,41.78 83.44,42.29 83.44,42.8 82.93,43.31 65.28,43.31 64.77,43.81 U9.4
DB9_DTR
  Bottom 0.254: M3.4 83.92,45.95 83.44,45.47 83.44,44.32 82.93,43.81 67.82,43.81 67.31,44.32 U9.5
DB9_RTS
  Bottom 0.254: U9.18 62.23,55.37 62.74,55.88 80.64,55.88 81.15,55.37 81.15,51.05 81.66,50.55 85.85,50.55 86.36,50.04 86.36,42.33 86.89,41.8 M3.7
DB9_RXD
  Top 0.254: U8.19 59.69,38.73 60.2,38.23 82.68,38.23 83.19,38.73 83.19,39.88 83.72,40.41 M3.2
DB9_TXD
  Top 0.254: U8.18 62.23,39.24 62.74,38.73 82.04,38.73 82.55,39.24 82.55,42.67 83.06,43.18 M3.3
DSR1
  Top 0.254: U9.3 62.23,51.05 61.72,51.56 53.85,51.56 53.34,52.07 53.34,65.91 52.96,66.29 23.37,66.29 22.86,66.8 M1.46
DTR1
  Top 0.254: U9.2 59.69,50.55 59.18,51.05 53.34,51.05 52.83,51.56 52.83,65.28 52.32,65.79 20.83,65.79 20.32,66.29 M1.47
GND  (via drill 0.35)
  Top 1.016: U5.8 91.44,13.21 90.68,13.97 69.6,13.97 68.58,12.95 | U4.8 68.58,12.95 | 68.58,12.95 67.56,13.97 46.74,13.97 45.72,12.95 | 45.72,12.95 U3.8 | 45.72,12.95 44.7,13.97 23.88,13.97 22.86,12.95 | U2.8 22.86,12.95 | U9.9 77.47,47.75 78.44,48.72 83.67,48.72 | JP2.18 JP2.20 JP2.22 JP2.24 JP2.26 46.74,52.07 47.75,51.05 47.75,44.2 46.74,43.18 41.66,43.18 40.64,42.16 | 22.86,12.95 21.84,13.97 3.56,13.97 2.54,12.95 v2.54,3.68 | U1.4 45.72,30.73 46.74,29.72 68.83,29.72 69.85,30.73 U8.6 | 83.67,48.72 82.55,49.84 82.55,56.13 81.53,57.15 LED4.C LED3.C 78.89,90.27 77.72,91.44 M1.1 v68.58,87.25 | LED1.C LED2.C 30.63,34.44 31.75,35.56 31.75,42.16 32.77,43.18 39.62,43.18 40.64,42.16 | U1.7 40.64,42.16 | 83.67,48.72 M3.5
  Bottom 1.016: R15.1 R14.1 R13.1 68.71,3.68 JP11.2 JP11.1 U4.8 70.1,11.43 71.12,12.45 71.12,20.07 69.85,21.34 U8.6 69.85,35.05 | U2.8 JP9.1 JP9.2 22.99,3.68 R5.1 R6.1 R7.1 | U3.8 JP10.1 JP10.2 45.85,3.68 R9.1 R10.1 R11.1 | JP12.2 JP12.1 U5.8 | U9.6 69.85,47.75 | U9.9 77.47,47.75 76.45,48.77 70.87,48.77 69.85,47.75 | U8.9 77.47,35.05 76.45,36.07 70.87,36.07 69.85,35.05 | v2.54,3.68 R1.1 R2.1 R3.1 | U1.2 U1.1 9.91,33.02 8.89,34.04 M2.GND | U1.2 U1.3 U1.4 | U1.7 U1.2 | 69.85,47.75 68.83,48.77 56.39,48.77 55.37,47.75 55.37,37.08 56.39,36.07 68.83,36.07 69.85,35.05 | U10.7 60.96,86.23 61.98,87.25 v68.58,87.25
  pour Top: 96.52,99.06 0,99.06 0,0 96.52,0
  pour Bottom: 96.52,99.06 0,99.06 0,0 96.52,0
MOTOROLA_A0
  Bottom 0.254: M1.21 17.78,92.71 17.27,93.22 14.48,93.22 13.97,92.71 13.97,50.04 14.48,49.53 JP2.1
MOTOROLA_A1
  Bottom 0.254: M1.22 15.24,86.11 15.24,70.48 16.51,69.22 16.51,67.94 15.24,66.67 JP2.2
MOTOROLA_A2
  Bottom 0.254: M1.38 43.18,69.6 42.67,70.1 39.88,70.1 39.37,69.6 39.37,67.06 38.86,66.55 17.02,66.55 16.51,66.04 16.51,50.04 17.02,49.53 JP2.3
MOTOROLA_A3
  Bottom 0.254: M1.39 40.64,66.55 40.13,66.04 18.29,66.04 17.78,65.53 JP2.4
MOTOROLA_A4
  Bottom 0.254: M1.8 50.8,88.65 51.31,88.14 70.61,88.14 71.12,87.63 71.12,66.04 70.61,65.53 19.56,65.53 19.05,65.02 19.05,50.04 19.56,49.53 JP2.5
MOTOROLA_A5
  Bottom 0.254: M1.7 53.34,89.15 53.85,88.65 71.12,88.65 71.63,88.14 71.63,65.53 71.12,65.02 20.83,65.02 20.32,64.52 JP2.6
MOTOROLA_A6
  Bottom 0.254: M1.6 55.88,89.66 56.39,89.15 71.63,89.15 72.14,88.65 72.14,65.02 71.63,64.52 22.1,64.52 21.59,64.01 21.59,50.04 22.1,49.53 JP2.7
MOTOROLA_A7
  Bottom 0.254: M1.5 58.42,90.17 58.93,89.66 72.14,89.66 72.64,89.15 72.64,64.52 72.14,64.01 23.37,64.01 22.86,63.5 JP2.8
MOTOROLA_ACK
  Bottom 0.254: JP2.25 46.48,49.53 46.99,50.04 46.99,59.94 47.5,60.45 75.69,60.45 76.2,60.96 76.2,95.76 75.69,96.27 25.91,96.27 25.4,95.76 M1.18
MOTOROLA_D0
  Bottom 0.254: M1.14 35.56,89.15 36.07,88.65 46.48,88.65 46.99,89.15 46.99,92.71 47.5,93.22 72.64,93.22 73.15,92.71 73.15,64.01 72.64,63.5 24.64,63.5 24.13,62.99 24.13,50.04 24.64,49.53 JP2.9
MOTOROLA_D1
  Bottom 0.254: M1.12 40.64,90.17 41.15,89.66 43.94,89.66 44.45,90.17 44.45,93.22 44.96,93.73 73.15,93.73 73.66,93.22 73.66,63.5 73.15,62.99 25.78,62.99 25.4,62.61 JP2.10
MOTOROLA_D2
  Bottom 0.254: M1.11 43.18,93.73 43.69,94.23 73.66,94.23 74.17,93.73 74.17,62.99 73.66,62.48 27.18,62.48 26.67,61.98 26.67,50.04 27.18,49.53 JP2.11
MOTOROLA_D3
  Bottom 0.254: JP2.12 27.94,53.21 28.45,53.72 31.24,53.72 31.75,53.21 31.75,47.37 32.26,46.86 47.5,46.86 48.01,47.37 48.01,58.93 48.51,59.44 76.71,59.44 77.22,59.94 77.22,96.77 76.71,97.28 6.86,97.28 6.35,96.77 6.35,88.77 5.84,88.27 M1.57
MOTOROLA_D4
  Bottom 0.254: JP2.13 30.48,47.88 29.97,47.37 12.7,47.37 12.19,47.88 12.19,66.04 11.68,66.55 9.4,66.55 8.89,67.06 8.89,87.76 8.38,88.27 M1.56
MOTOROLA_D5
  Bottom 0.254: M1.23 12.7,70.48 11.43,69.22 11.43,67.94 12.7,66.67 12.7,48.39 13.21,47.88 28.7,47.88 29.21,48.39 29.21,51.56 29.72,52.07 JP2.14
MOTOROLA_D6
  Bottom 0.254: M1.24 10.16,96.27 10.67,96.77 76.2,96.77 76.71,96.27 76.71,60.45 76.2,59.94 48.01,59.94 47.5,59.44 47.5,47.88 46.99,47.37 33.53,47.37 33.02,47.88 JP2.15
MOTOROLA_D7
  Bottom 0.254: M1.15 33.02,94.23 33.53,94.74 74.17,94.74 74.68,94.23 74.68,62.48 74.17,61.98 28.45,61.98 27.94,61.47 27.94,54.74 28.45,54.23 32.51,54.23 33.02,53.72 JP2.16
MOTOROLA_INT  (via drill 0.35)
  Top 0.254: v39.37,54.23 39.37,63.25 38.86,63.75 10.67,63.75 10.16,64.26 M1.51
  Bottom 0.254: v39.37,54.23 39.37,50.04 39.88,49.53 JP2.21
MOTOROLA_RW
  Bottom 0.254: JP2.19 38.1,48.39 38.61,47.88 43.94,47.88 44.45,48.39 44.45,53.21 44.96,53.72 45.97,53.72 46.48,54.23 46.48,60.45 46.99,60.96 75.18,60.96 75.69,61.47 75.69,95.25 75.18,95.76 28.45,95.76 27.94,95.25 M1.17
MOTOROLA_STR
  Bottom 0.254: JP2.23 42.42,49.53 41.91,50.04 41.91,53.72 42.42,54.23 45.47,54.23 45.97,54.74 45.97,60.96 46.48,61.47 74.68,61.47 75.18,61.98 75.18,94.74 74.68,95.25 30.99,95.25 30.48,94.74 M1.16
N$1
  Bottom 0.254: U3.13 35.56,20.45 36.07,20.95 38.99,20.95 39.5,21.47 R8.2
N$2
  Bottom 0.254: R17.1 50.93,83.8 50.93,82.42 51.41,81.94 55.37,81.94 55.88,82.45 U10.3
N$3
  Bottom 0.254: R12.2 62.36,21.47 61.85,20.95 58.93,20.95 58.42,20.45 U4.13
N$4
  Bottom 0.254: U2.13 12.7,20.45 13.21,20.95 16.13,20.95 16.64,21.47 R4.2
N$5
  Bottom 0.254: U10.6 59.69,82.04 60.2,81.53 62.87,81.53 63.35,82.02 R19.1
N$6
  Bottom 0.254: R18.1 50.95,80.01 51.46,80.52 56.64,80.52 57.15,80.01 U10.11
N$8
  Bottom 0.254: R16.2 85.22,21.47 84.71,20.95 81.79,20.95 81.28,20.45 U5.13
N$9
  Bottom 0.254: U8.17 64.77,42.29 65.28,42.8 76.96,42.8 77.47,42.29 U8.12
N$10
  Bottom 0.254: U10.8 60.96,80.49 61.49,81.03 62.87,81.03 63.35,80.54 R20.1
N$13
  Bottom 0.254: U8.16 67.31,38.73 67.82,38.23 79.5,38.23 80.01,37.72 U8.10
N$14
  Bottom 0.254: U8.15 69.85,39.24 70.36,38.73 79.5,38.73 80.01,39.24 U8.11
N$15
  Bottom 0.254: U9.17 64.77,54.86 65.28,55.37 76.96,55.37 77.47,54.86 U9.12
N$16
  Bottom 0.254: U9.16 67.31,51.44 67.82,50.93 79.5,50.93 80.01,50.42 U9.10
N$17
  Bottom 0.254: U9.11 80.01,51.94 79.5,51.44 70.36,51.44 69.85,51.94 U9.15
N$18  (via drill 0.35)
  Top 0.254: v69.09,83.82 75.56,83.82 76.05,83.34 LED3.A
  Bottom 0.254: R19.2 v69.09,83.82
N$19  (via drill 0.35)
  Top 0.254: v69.09,78.74 73.53,78.74 74.04,78.23 74.04,57.66 74.55,57.15 LED4.A
  Bottom 0.254: R20.2 v69.09,78.74
N$23  (via drill 0.35, 0.35 pad 0.55)
  Top 0.254: v44.2,78.74 44.2,73.91 44.7,73.41 54.1,73.41 54.61,72.9 v54.61,57.15 | LED2.A v27.94,29.21
  Bottom 0.254: v54.61,57.15 50.04,57.15 49.53,56.64 49.53,29.72 49.02,29.21 v27.94,29.21 | v44.2,78.74 R18.2
N$24  (via drill 0.35, 0.4 pad 0.55)
  Top 0.254: v44.96,83.82 44.96,74.42 45.47,73.91 56.64,73.91 57.15,73.41 v57.15,56.39 | v25.4,28.45 LED1.A
  Bottom 0.254: v25.4,28.45 49.53,28.45 50.04,28.96 50.04,55.88 50.55,56.39 v57.15,56.39 | v44.96,83.82 R17.2
PCF0_A0
  Bottom 0.254: R1.2 U2.1 4.32,11.43 3.81,11.94 3.81,27.05 4.32,27.56 9.65,27.56 10.16,27.05 JP1.6
PCF0_A1
  Bottom 0.254: R2.2 U2.2 6.86,11.43 6.35,11.94 6.35,24.89 6.86,25.4 JP1.4
PCF0_A2
  Bottom 0.254: R3.2 U2.3 9.4,11.43 8.89,11.94 8.89,26.54 8.38,27.05 5.46,27.05 5.08,26.67 JP1.2
PCF0_D0
  Bottom 0.254: JP9.9 U2.4
PCF0_D1
  Bottom 0.254: U2.5 JP9.7
PCF0_D2
  Bottom 0.254: JP9.5 U2.6
PCF0_D3
  Bottom 0.254: U2.7 JP9.3
PCF0_D4
  Bottom 0.254: JP9.4 21.08,3.81 21.59,4.32 21.59,18.54 22.1,19.05 U2.9
PCF0_D5
  Bottom 0.254: JP9.6 18.54,3.81 19.05,4.32 19.05,18.54 19.56,19.05 U2.10
PCF0_D6
  Bottom 0.254: U2.11 17.02,19.05 16.51,18.54 16.51,4.32 16,3.81 JP9.8
PCF0_D7
  Bottom 0.254: JP9.10 13.46,3.81 13.97,4.32 13.97,18.54 14.48,19.05 U2.12
PCF1_A0
  Bottom 0.254: R5.2 U3.1 27.18,11.43 26.67,11.94 26.67,27.05 27.18,27.56 32.51,27.56 33.02,27.05 JP5.6
PCF1_A1
  Bottom 0.254: R6.2 U3.2 29.72,11.43 29.21,11.94 29.21,24.89 29.72,25.4 JP5.4
PCF1_A2
  Bottom 0.254: R7.2 U3.3 32.26,11.43 31.75,11.94 31.75,26.54 31.24,27.05 28.45,27.05 27.94,26.54 JP5.2
PCF1_D0
  Bottom 0.254: U3.4 JP10.9
PCF1_D1
  Bottom 0.254: U3.5 JP10.7
PCF1_D2
  Bottom 0.254: U3.6 JP10.5
PCF1_D3
  Bottom 0.254: U3.7 JP10.3
PCF1_D4
  Bottom 0.254: U3.9 44.96,19.05 44.45,18.54 44.45,4.32 43.94,3.81 JP10.4
PCF1_D5
  Bottom 0.254: JP10.6 41.4,3.81 41.91,4.32 41.91,18.54 42.42,19.05 U3.10
PCF1_D6
  Bottom 0.254: JP10.8 38.86,3.81 39.37,4.32 39.37,18.54 39.88,19.05 U3.11
PCF1_D7
  Bottom 0.254: JP10.10 36.32,3.81 36.83,4.32 36.83,18.54 37.34,19.05 U3.12
PCF2_A0
  Bottom 0.254: R9.2 U4.1 50.04,11.43 49.53,11.94 49.53,27.05 50.04,27.56 55.37,27.56 55.88,27.05 JP7.6
PCF2_A1
  Bottom 0.254: R10.2 U4.2 52.58,11.43 52.07,11.94 52.07,24.89 52.58,25.4 JP7.4
PCF2_A2
  Bottom 0.254: R11.2 U4.3 55.12,11.43 54.61,11.94 54.61,26.54 54.1,27.05 51.31,27.05 50.8,26.54 JP7.2
PCF2_D0
  Bottom 0.254: JP11.9 U4.4
PCF2_D1
  Bottom 0.254: JP11.7 U4.5
PCF2_D2
  Bottom 0.254: JP11.5 U4.6
PCF2_D3
  Bottom 0.254: U4.7 JP11.3
PCF2_D4
  Bottom 0.254: JP11.4 66.8,3.81 67.31,4.32 67.31,18.54 67.82,19.05 U4.9
PCF2_D5
  Bottom 0.254: JP11.6 64.26,3.81 64.77,4.32 64.77,18.54 65.28,19.05 U4.10
PCF2_D6
  Bottom 0.254: JP11.8 61.72,3.81 62.23,4.32 62.23,18.54 62.74,19.05 U4.11
PCF2_D7
  Bottom 0.254: JP11.10 59.05,3.81 59.69,4.45 59.69,18.54 60.2,19.05 U4.12
PCF3_A0
  Bottom 0.254: R13.2 U5.1 72.9,11.43 72.39,11.94 72.39,27.05 72.9,27.56 78.23,27.56 78.74,27.05 JP8.6
PCF3_A1
  Bottom 0.254: R14.2 U5.2 75.44,11.43 74.93,11.94 74.93,24.89 75.44,25.4 JP8.4
PCF3_A2
  Bottom 0.254: R15.2 U5.3 77.98,11.43 77.47,11.94 77.47,26.54 76.96,27.05 74.17,27.05 73.66,26.54 JP8.2
PCF3_D0
  Bottom 0.254: JP12.9 U5.4
PCF3_D1
  Bottom 0.254: JP12.7 U5.5
PCF3_D2
  Bottom 0.254: JP12.5 U5.6
PCF3_D3
  Bottom 0.254: JP12.3 U5.7
PCF3_D4
  Bottom 0.254: JP12.4 89.66,3.81 90.17,4.32 90.17,18.54 90.68,19.05 U5.9
PCF3_D5
  Bottom 0.254: JP12.6 87.12,3.81 87.63,4.32 87.63,18.54 88.14,19.05 U5.10
PCF3_D6
  Bottom 0.254: JP12.8 84.58,3.81 85.09,4.32 85.09,18.54 85.6,19.05 U5.11
PCF3_D7
  Bottom 0.254: JP12.10 82.04,3.81 82.55,4.32 82.55,18.54 83.06,19.05 U5.12
RTS1
  Top 0.254: U9.1 57.15,50.04 56.64,50.55 52.83,50.55 52.32,51.05 52.32,64.77 51.82,65.28 15.75,65.28 15.24,65.79 M1.49
RXD1
  Top 0.254: U8.20 52.32,40.64 51.82,41.15 51.82,64.26 51.31,64.77 14.48,64.77 13.97,65.28 13.97,69.85 14.48,70.36 29.97,70.36 30.48,69.85 M1.43
  Bottom 0.254: M1.43 30.48,67.56 30.99,67.06 33.78,67.06 34.29,67.56 34.29,80.52 34.8,81.03 59.18,81.03 59.69,80.52 U10.9
RXD3  (via drill 0.35)
  Top 0.254: v59.69,58.67 59.69,73.91 59.18,74.42 46.19,74.42 45.72,74.89 M1.10
  Bottom 0.254: v59.69,58.67 49.02,58.67 48.51,58.17 48.51,46.86 48.01,46.35 25.91,46.35 25.4,45.85 JP13.2 | M1.10 45.72,89.66 45.21,89.15 37.34,89.15 36.83,89.66 36.83,92.71 36.32,93.22 34.8,93.22 34.29,92.71 34.29,86.78 34.71,86.36 52.83,86.36 53.34,85.85 U10.1
SCL0  (via drill 0.35)
  Top 0.254: v78.74,15.49 v55.88,15.49 v33.02,15.49 v10.16,15.49 v2.16,15.49 | v3.81,73.66 3.81,90.93 4.32,91.44 M1.26 | v2.16,31.75 16,31.75 16.51,32.26 JP4.2
  Bottom 0.254: U5.14 v78.74,15.49 | v55.88,15.49 U4.14 | v33.02,15.49 U3.14 | v10.16,15.49 U2.14 | v3.81,73.66 3.81,67.56 3.3,67.06 2.67,67.06 2.16,66.55 v2.16,31.75 v2.16,15.49 | U1.6 43.18,44.32 42.67,44.83 30.23,44.83 29.72,44.32 29.72,35.69 29.21,35.18 17.02,35.18 16.51,35.69 JP4.2
SDA0  (via drill 0.35)
  Top 0.254: v76.2,16.76 v53.34,16.76 v30.48,16.76 v7.62,16.76 v2.92,16.76 | v6.35,73.66 6.35,90.93 6.86,91.44 M1.25 | JP4.1 19.05,31.11 18.54,30.61 v2.92,30.61
  Bottom 0.254: U2.15 v7.62,16.76 | v30.48,16.76 U3.15 | v53.34,16.76 U4.15 | v76.2,16.76 U5.15 | v6.35,73.66 6.35,67.06 5.84,66.55 3.43,66.55 2.92,66.04 v2.92,30.61 v2.92,16.76 | U1.5 45.72,44.83 45.21,45.34 29.72,45.34 29.21,44.83 29.21,36.2 28.7,35.69 19.56,35.69 19.05,36.2 JP4.1
TXD1
  Top 0.254: U8.1 51.82,33.02 51.31,33.53 51.31,63.75 50.8,64.26 11.94,64.26 11.43,64.77 11.43,70.36 11.94,70.87 32.51,70.87 33.02,70.36 M1.42
  Bottom 0.254: M1.42 33.02,81.03 33.53,81.53 56.64,81.53 57.15,82.04 U10.4
TXD3  (via drill 0.35)
  Top 0.254: M1.9 48.26,75.69 48.77,75.18 v55.88,75.18 61.72,75.18 62.23,74.68 v62.23,57.91
  Bottom 0.254: v62.23,57.91 49.53,57.91 49.02,57.4 49.02,46.35 48.51,45.85 28.45,45.85 27.94,45.34 JP13.1 | v55.88,75.18 U10.12
USB_DM
  Top 0.508: M2.D- 7.11,45.72 6.35,46.48 6.35,71.5 7.11,72.26 47.5,72.26 48.26,71.5 M1.36
USB_DP
  Top 0.508: M2.D+ 10.92,43.18 11.68,43.94 11.68,62.36 10.92,63.12 9.65,63.12 8.89,63.88 8.89,70.74 9.65,71.5 44.96,71.5 45.72,70.74 M1.37

### Text on the board
tNames: M1
_tsilk: 1 | TX | IPS-100 v3.1 / A.DAUPHINAIS | RS232 | RX | MAX233 | 1 | 1 | I2C0 | UART3 | EEPROM | SCL | SDA | RX | TX | 24LC256 | MAX233 | 1 | 1 | A2 | A1 | A0 | A2 | A1 | A0 | A2 | A1 | A0 | A2 | A1 | A0 | PCF8574 | PCF8574 | PCF8574 | PCF8574 | GND | GND | GND | GND | D0 | D0 | D0 | D0 | D7 | D7 | D7 | D7
_bsilk: 74ALS08 | 1